# EAGLE schematic ATtiny861devbrdtst1 (EAGLE 5.06)
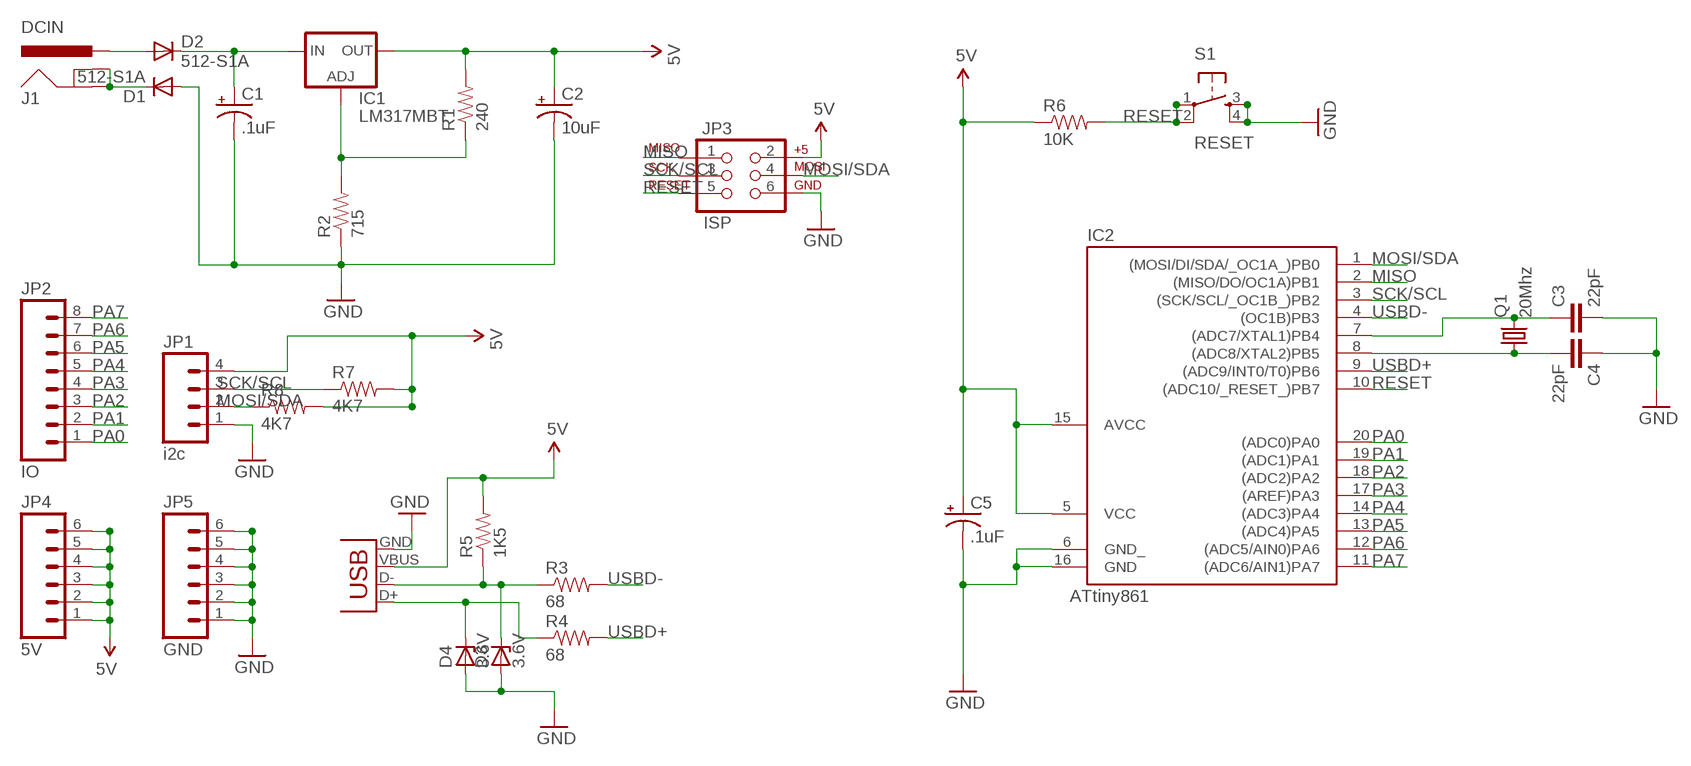
[diagram p0: schematic, sheet 1]

## Parts
C1  .1uF  CAP_POLPTH2  [CPOL-RADIAL-10UF-25V]
C2  10uF  CAP_POLPTH2  [CPOL-RADIAL-10UF-25V]
C3  22pF  CAPPTH2  [CAP-PTH-SMALL2]
C4  22pF  CAPPTH2  [CAP-PTH-SMALL2]
C5  .1uF  CAP_POLPTH2  [CPOL-RADIAL-10UF-25V]
D1  512-S1A  DIODE1N4148  [DIODE-1N4148]
D2  512-S1A  DIODE1N4148  [DIODE-1N4148]
D3  3.6V  BZX90  [DO34Z7]
D4  3.6V  BZX90  [DO34Z7]
IC1  LM317MBT  [TO220L1]
IC2  ATtiny861  TINY26P  [DIL20]
J1  DCIN  POWER_JACKPTH  [POWER_JACK_PTH]
JP1  i2c  M04PTH  [1X04]
JP2  IO  M08LONGPADS  [1X08_LONGPADS]
JP3  ISP  AVR_SPI_PRG_6PTH  [2X3]
JP4  5V  M06LONGPADS  [1X06_LONGPADS]
JP5  GND  M06LONGPADS  [1X06_LONGPADS]
Q1  20Mhz  CRYSTALHC49UV  [HC49U-V]
R1  240  RESISTORPTH1  [AXIAL-0.3]
R2  715  RESISTORPTH1  [AXIAL-0.3]
R3  68  RESISTORPTH1  [AXIAL-0.3]
R4  68  RESISTORPTH1  [AXIAL-0.3]
R5  1K5  RESISTORPTH1  [AXIAL-0.3]
R6  10K  RESISTORPTH1  [AXIAL-0.3]
R7  4K7  RESISTORPTH1  [AXIAL-0.3]
R8  4K7  RESISTORPTH1  [AXIAL-0.3]
S1  RESET  TAC_SWITCHPTH  [TACTILE-PTH]
X1  USBPTH  [USB-B-PTH]

## Nets
5V: C2.1(+) C5.1(+) IC1.2(OUT) IC2.5(VCC) IC2.15(AVCC) JP1.4 JP3.2 JP4.1 JP4.2 JP4.3 JP4.4 JP4.5 JP4.6 R1.P$2 R5.P$2 R6.P$1 R7.P$2 R8.P$2 X1.VBUS
GND: C1.2(-) C2.2(-) C3.2 C4.1 C5.2(-) D1.A D3.A D4.A IC2.6(GND_) IC2.16(GND) JP1.1 JP3.6 JP5.1 JP5.2 JP5.3 JP5.4 JP5.5 JP5.6 R2.P$1 S1.3 S1.4 X1.GND
MISO: IC2.2((MISO/DO/OC1A)PB1) JP3.1
MOSI/SDA: IC2.1((MOSI/DI/SDA/_OC1A_)PB0) JP1.2 JP3.4 R8.P$1
N$1: D2.A J1.PWR
N$2: C1.1(+) D2.C IC1.3(IN)
N$3: D1.C J1.GND J1.GNDBREAK
N$5: D3.C R3.P$1 R5.P$1 X1.D-
N$6: IC1.1(ADJ) R1.P$1 R2.P$2
N$8: C3.1 IC2.7((ADC7/XTAL1)PB4) Q1.2
N$9: D4.C R4.P$1 X1.D+
N$10: C4.2 IC2.8((ADC8/XTAL2)PB5) Q1.1
PA0: IC2.20((ADC0)PA0) JP2.1
PA1: IC2.19((ADC1)PA1) JP2.2
PA2: IC2.18((ADC2)PA2) JP2.3
PA3: IC2.17((AREF)PA3) JP2.4
PA4: IC2.14((ADC3)PA4) JP2.5
PA5: IC2.13((ADC4)PA5) JP2.6
PA6: IC2.12((ADC5/AIN0)PA6) JP2.7
PA7: IC2.11((ADC6/AIN1)PA7) JP2.8
RESET: IC2.10((ADC10/_RESET_)PB7) JP3.5 R6.P$2 S1.1 S1.2
SCK/SCL: IC2.3((SCK/SCL/_OC1B_)PB2) JP1.3 JP3.3 R7.P$1
USBD+: IC2.9((ADC9/INT0/T0)PB6) R4.P$2
USBD-: IC2.4((OC1B)PB3) R3.P$2

## Library data of the parts
C1 C2 C5 = SparkFun-2009-11-03:CAP_POL: Capacitor Polarized These are standard SMD and PTH capacitors. Normally 10uF, 47uF, and 100uF in electrolytic and tantalum varieties. Always verify the external diameter of the through hole cap, it varies with capacity, voltage, and manufacturer. The EIA devices should be standard.
C3 C4 = SparkFun-2009-11-03:CAP: Capacitor Standard 0603 ceramic capacitor, and 0.1" leaded capacitor.
D1 D2 = SparkFun-2009-11-03:DIODE: Diode These are standard reverse protection diodes and small signal diodes. SMA package can handle up to about 1A. SOD-323 can handle about 200mA. What the SOD-323 package when ordering, there are some mfgs out there that are 5-pin packages.
D3 D4 = diode:BZX90: Z DIODE
IC1 = v-reg:LM317?*: 500 mA Adjustable Output Positive Voltage Regulator Source: http://www.onsemi.co.jp .. LM317M-D.PDF
IC2 = avr-6:TINY26: Atmel Tiny26/261/461/861
J1 = SparkFun-2009-11-03:POWER_JACK: Power Jack This is the standard 5.5mm barrel jack for power. The PTH is the most common, proven, reliable, footprint. All others are experimental. The Slot footprint only works if the mill layer is transmitted to the PCB fab house so be warned. Spark Fun Electronics SKU : PRT-00119. Mating wall wart : TOL-00298 (and others)
JP1 = SparkFun-2009-11-03:M04: Header 4 Standard 4-pin 0.1" header. Use with straight break away headers (SKU : PRT-00116), right angle break away headers (PRT-00553), swiss pins (PRT-00743), machine pins (PRT-00117), and female headers (PRT-00115). Molex polarized connector foot print use with SKU : PRT-08231 with associated crimp pins and housings.
JP2 = SparkFun-2009-11-03:M08: Header 8 Standard 8-pin 0.1" header. Use with straight break away headers (SKU : PRT-00116), right angle break away headers (PRT-00553), swiss pins (PRT-00743), machine pins (PRT-00117), and female headers (PRT-00115).
JP3 = SparkFun-2009-11-03:AVR_SPI_PRG_6: AVR ISP 6 Pin This is the reduced ISP connector for AVR programming. Common on Arduino. This footprint will take up less PCB space and can be used with a 10-pin to 6-pin adapter such as SKU: BOB-08508
JP4 JP5 = SparkFun-2009-11-03:M06: Header 6 Standard 6-pin 0.1" header. Use with straight break away headers (SKU : PRT-00116), right angle break away headers (PRT-00553), swiss pins (PRT-00743), machine pins (PRT-00117), and female headers (PRT-00115). Molex polarized connector foot print use with SKU : PRT-08094 with associated crimp pins and housings. NOTES ON THE VARIANTS LOCK and LOCK_LONGPADS... This footprint was designed to help hold the alignment of a through-hole component (i.e. 6-pin header) while soldering it into place. You may notice that each hole has been shifted either up or down by 0.005 of an inch from it's more standard position (which is a perfectly straight line). This slight alteration caused the pins (the squares in the middle) to touch the edges of the holes. Because they are alternating, it causes a "brace" to hold the component in place. 0.005 has proven to be the perfect amount of "off-center" position when using our standard breakaway headers. Although looks a little odd when you look at the bare footprint, once you have a header in there, the alteration is very hard to notice. Also, if you push a header all the way into place, it is covered up entirely on the bottom side. This idea of altering the position of holes to aid alignment will be further integrated into the Sparkfun Library for other footprints. It can help hold any component with 3 or more connection pins.
Q1 = SparkFun:CRYSTAL: Crystals Various standard crystals. Proven footprints. Spark Fun Electronics SKU : COM-00534
R1-R8 = SparkFun-2009-11-03:RESISTOR: Resistor Basic schematic elements and footprints for 0603, 1206, and PTH 1/10th watt (small) resistors.
S1 = SparkFun-2009-11-03:TAC_SWITCH: Momentary Switch Button commonly used for reset or general input. Spark Fun Electronics SKU : COM-00097
X1 = SparkFun-2009-11-03:USB: USB Connectors USB-B-PTH is fully proven SKU : PRT-00139 USB-miniB is fully proven SKU : PRT-00587 USB-A-PCB is untested. USB-A-H is throughly reviewed, but untested. Spark Fun Electronics SKU : PRT-00437 USB-B-SMT is throughly reviewed, but untested. Needs silkscreen touching up. USB-A-S has not been used/tested USB-MB-H has not been used/tested